# EAGLE design rfid_ctl (EAGLE 6.6.0)
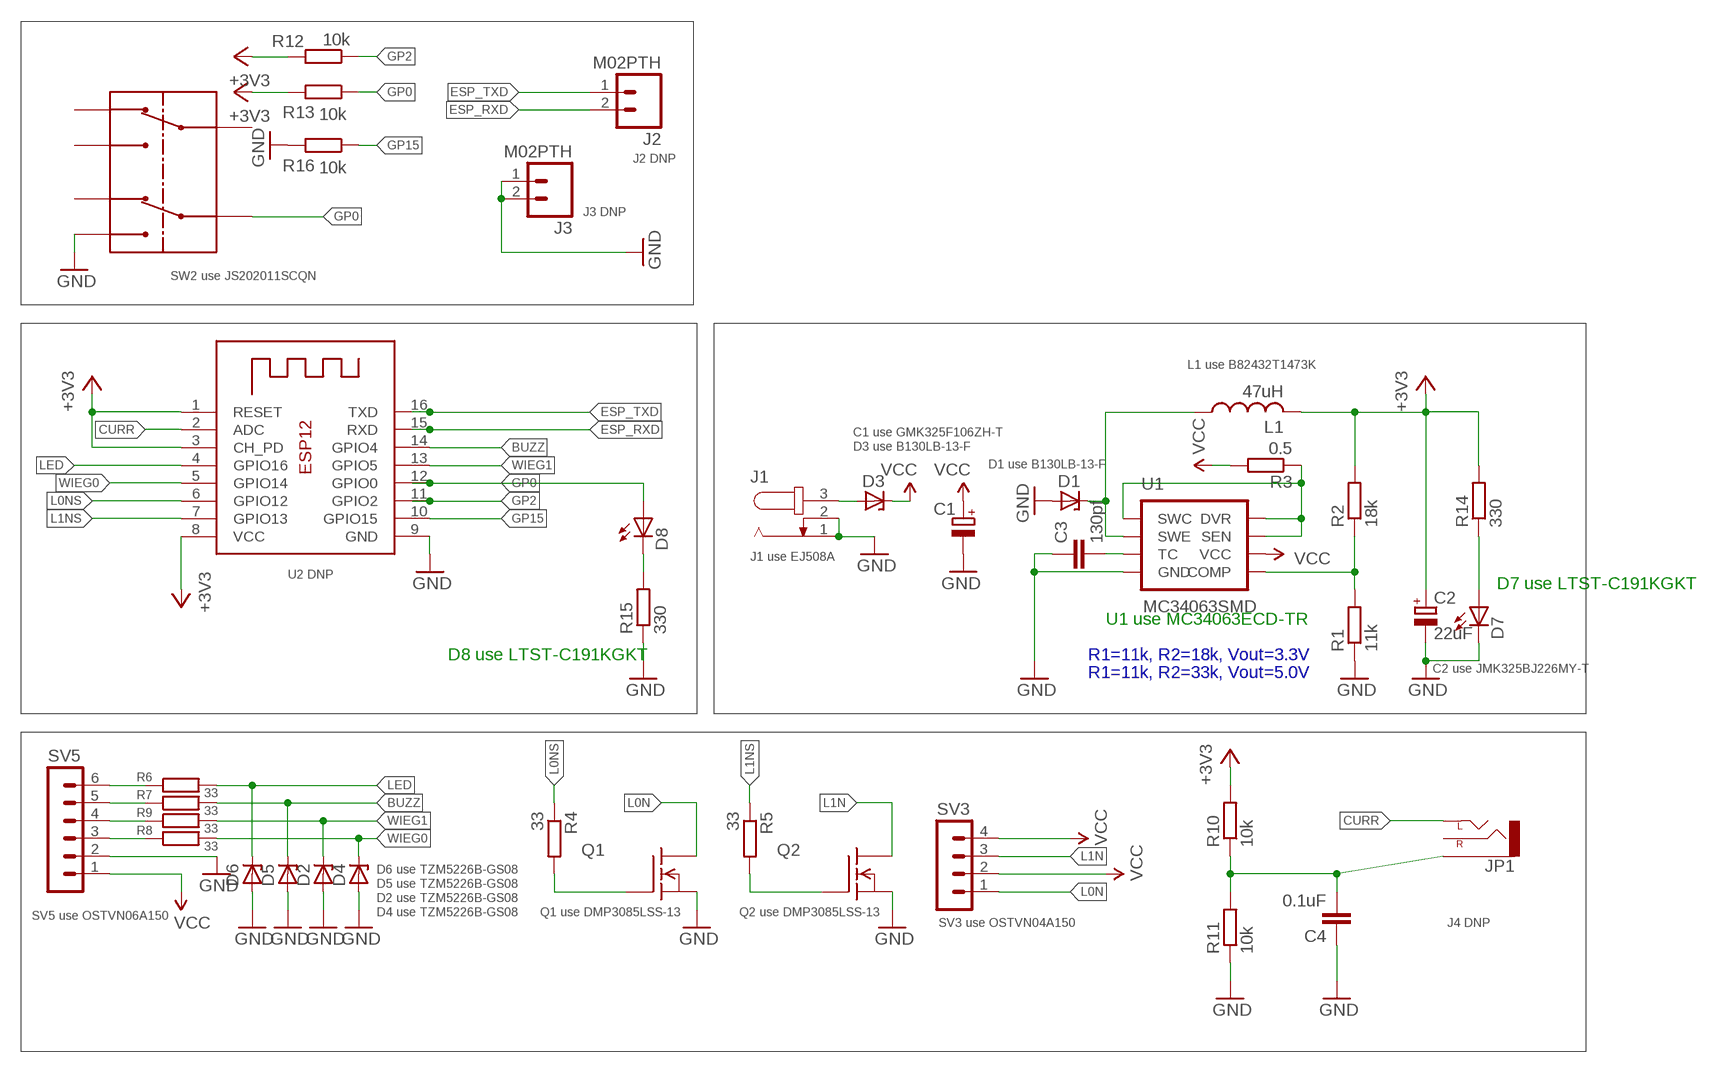
[diagram p0: schematic, sheet 1]

## Parts
C1  CPOL-EUB/3528-21R  [B/3528-21R]
C2  22uF  CPOL-EUB/3528-21R  [B/3528-21R]
C3  130pf  C-EUC0603  [C0603]
C4  0.1uF  C-EUC0603  [C0603]
D1  ZENER-DIODESMB  [SMB]
D2  ZENER-DIODESOD80C  [SOD80C]
D3  ZENER-DIODESMB  [SMB]
D4  ZENER-DIODESOD80C  [SOD80C]
D5  ZENER-DIODESOD80C  [SOD80C]
D6  ZENER-DIODESOD80C  [SOD80C]
D7  LEDCHIP-LED0603  [CHIP-LED0603]
D8  LEDCHIP-LED0603  [CHIP-LED0603]
J1  JACK-PLUG0  [SPC4077]
J2  M02PTH  [1X02]
J3  M02PTH  [1X02]
JP1  AUDIO-JACKSMD2  [AUDIO-JACK-3.5MM-SMD]
L1  47uH  L-USL1812  [L1812]
Q1  FDS5680  [SO-8]
Q2  FDS5680  [SO-8]
R1  11k  R-EU_R0603  [R0603]
R2  18k  R-EU_R0603  [R0603]
R3  0.5  R-EU_R0603  [R0603]
R4  33  R-EU_R0603  [R0603]
R5  33  R-EU_R0603  [R0603]
R6  33  R-EU_R0603  [R0603]
R7  33  R-EU_R0603  [R0603]
R8  33  R-EU_R0603  [R0603]
R9  33  R-EU_R0603  [R0603]
R10  10k  R-EU_R0603  [R0603]
R11  10k  R-EU_R0603  [R0603]
R12  10k  R-EU_R0603  [R0603]
R13  10k  R-EU_R0603  [R0603]
R14  330  R-EU_R0603  [R0603]
R15  330  R-EU_R0603  [R0603]
R16  10k  R-EU_R0603  [R0603]
SV3  MA04-1  [MA04-1]
SV5  MA06-1  [MA06-1]
SW2  L202011MS02Q  [SMT]
U1  MC34063SMD  [SO08]
U2  ESP-12  [ESP-12]

## Nets
+3V3: C2.+ L1.2 R2.2 R10.2 R12.2 R13.2 R14.2 U2.1(RESET) U2.3(CH_PD) U2.8(VCC)
BUZZ: D5.C R7.2 U2.14(GPIO4)
CURR: JP1.TIP(LEFT) U2.2(ADC)
ESP_RXD: J2.2 U2.15(RXD)
ESP_TXD: J2.1 U2.16(TXD)
GND: C1.- C2.- C3.1 C4.1 D1.A D2.A D4.A D5.A D6.A D7.C J1.1 J1.2 J3.1 J3.2 Q1.1(S) Q1.2(S) Q1.3(S) Q2.1(S) Q2.2(S) Q2.3(S) R1.1 R11.1 R15.1 R16.2 SV5.2 SW2.B1 U1.4(GND) U2.9(GND)
GP0: D8.A R13.1 SW2.B U2.12(GPIO0)
GP2: R12.1 U2.11(GPIO2)
GP15: R16.1 U2.10(GPIO15)
L0N: Q1.5(D) Q1.6(D) Q1.7(D) Q1.8(D) SV3.1
L0NS: R4.1 U2.6(GPIO12)
L1N: Q2.5(D) Q2.6(D) Q2.7(D) Q2.8(D) SV3.3
L1NS: R5.1 U2.7(GPIO13)
LED: D6.C R6.2 U2.4(GPIO16)
N$1: Q1.4(G) R4.2
N$2: C3.2 U1.3(TC)
N$3: D1.C L1.1 U1.2(SWE)
N$4: Q2.4(G) R5.2
N$5: R1.2 R2.1 U1.5(COMP)
N$6: R3.1 U1.1(SWC) U1.7(SEN) U1.8(DVR)
N$7: D3.A J1.3
N$8: R6.1 SV5.6
N$9: R7.1 SV5.5
N$10: R8.1 SV5.4
N$11: R9.1 SV5.3
N$12: C4.2 JP1.SLEEVE R10.1 R11.2
N$13: D7.A R14.1
N$14: D8.C R15.2
VCC: C1.+ D3.C R3.2 SV3.2 SV3.4 SV5.1 U1.6(VCC)
WIEG0: D4.C R9.2 U2.5(GPIO14)
WIEG1: D2.C R8.2 U2.13(GPIO5)
Unconnected: JP1.RING(RIGHT) SW2.A SW2.A1 SW2.A2 SW2.B2

## Notes on the sheet
- J2 DNP
- J3 DNP
- SW2 use JS202011SCQN
- L1 use B82432T1473K
- C1 use GMK325F106ZH-T
- D3 use B130LB-13-F
- D1 use B130LB-13-F
- J1 use EJ508A
- U2 DNP
- D7 use LTST-C191KGKT
- U1 use MC34063ECD-TR
- D8 use LTST-C191KGKT | R1=11k, R2=18k, Vout=3.3V
- C2 use JMK325BJ226MY-T
- R1=11k, R2=33k, Vout=5.0V
- D6 use TZM5226B-GS08
- D5 use TZM5226B-GS08
- D2 use TZM5226B-GS08
- D4 use TZM5226B-GS08 | Q1 use DMP3085LSS-13 | Q2 use DMP3085LSS-13
- SV5 use OSTVN06A150
- SV3 use OSTVN04A150 | J4 DNP

## Library data of the parts
C1 C2 = rcl:CPOL-EU: POLARIZED CAPACITOR, European symbol
C3 C4 = rcl:C-EU: CAPACITOR, European symbol
D1-D6 = diode:ZENER-DIODE: Z-Diode
D7 D8 = adafruit:LED: LED OSRAM: - CHIPLED LG R971, LG N971, LY N971, LG Q971, LY Q971, LO R971, LY R971 LH N974, LH R974 LS Q976, LO Q976, LY Q976 LO Q996 - Hyper CHIPLED LW Q18S LB Q993, LB Q99A, LB R99A - SideLED LS A670, LO A670, LY A670, LG A670, LP A670 LB A673, LV A673, LT A673, LW A673 LH A674 LY A675 LS A676, LA A676, LO A676, LY A676, LW A676 LS A679, LY A679, LG A679 - Hyper Micro SIDELED® LS Y876, LA Y876, LO Y876, LY Y876 LT Y87S - SmartLED LW L88C, LW L88S LB L89C, LB L89S, LG L890 LS L89K, LO L89K, LY L89K LS L896, LA L896, LO L896, LY L896 - TOPLED LS T670, LO T670, LY T670, LG T670, LP T670 LSG T670, LSP T670, LSY T670, LOP T670, LYG T670 LG T671, LOG T671, LSG T671 LB T673, LV T673, LT T673, LW T673 LH T674 LS T676, LA T676, LO T676, LY T676, LB T676, LH T676, LSB T676, LW T676 LB T67C, LV T67C, LT T67C, LS T67K, LO T67K, LY T67K, LW E67C LS E67B, LA E67B, LO E67B, LY E67B, LB E67C, LV E67C, LT E67C LW T67C LS T679, LY T679, LG T679 LS T770, LO T770, LY T770, LG T770, LP T770 LB T773, LV T773, LT T773, LW T773 LH T774 LS E675, LA E675, LY E675, LS T675 LS T776, LA T776, LO T776, LY T776, LB T776 LHGB T686 LT T68C, LB T68C - Hyper Mini TOPLED® LB M676 - Mini TOPLED Santana® LG M470 LS M47K, LO M47K, LY M47K Source: http://www.osram.convergy.de/
J1 = con-jack:JACK-PLUG: DC POWER JACK Power Jack, DC, Right Angle, Through Hole, Rated 5A at 16VDC, PC Terminals Distributor: Farnell (www.Farnell.de) Drawing: 84N1161.pdf / 84N1162.pdf Manufacturer: SPC Technology (www.spctechnology.com) Type: SPC4077 / SPC 4078; OC_FARNELL: unknown; OC_NEWARK: unknown
J2 J3 = SparkFun-Connectors:M02: Standard 2-pin 0.1" header. Use with - straight break away headers ( PRT-00116) - right angle break away headers (PRT-00553) - swiss pins (PRT-00743) - machine pins (PRT-00117) - female headers (PRT-00115) Molex polarized connector foot print use with: PRT-08233 with associated crimp pins and housings. 2.54_SCREWTERM for use with PRT-10571. 3.5mm Screw Terminal footprints for PRT-08084 5mm Screw Terminal footprints for use with PRT-08432
JP1 = SparkFun-Connectors:AUDIO-JACK: 3.5mm Audio Jack Simple 3.5mm common PCB mount audio jack. SKU: PRT-08032; PROD_ID: CONN-10353
L1 = rcl:L-US: INDUCTOR, American symbol
Q1 Q2 = transistor-fet:FDS5680: 60V N-Channel PowerTrench TM MOSFET FAIRCHILD FDS5680.pdf
R1-R16 = rcl:R-EU_: RESISTOR, European symbol
SV3 = con-lstb:MA04-1: PIN HEADER; OC_FARNELL: unknown; OC_NEWARK: unknown
SV5 = con-lstb:MA06-1: PIN HEADER; OC_FARNELL: unknown; OC_NEWARK: unknown
SW2 = JS202011SCQNC&K:L202011MS02Q
U1 = SparkFun:MC34063
U2 = adafruit:ESP-12

## Board
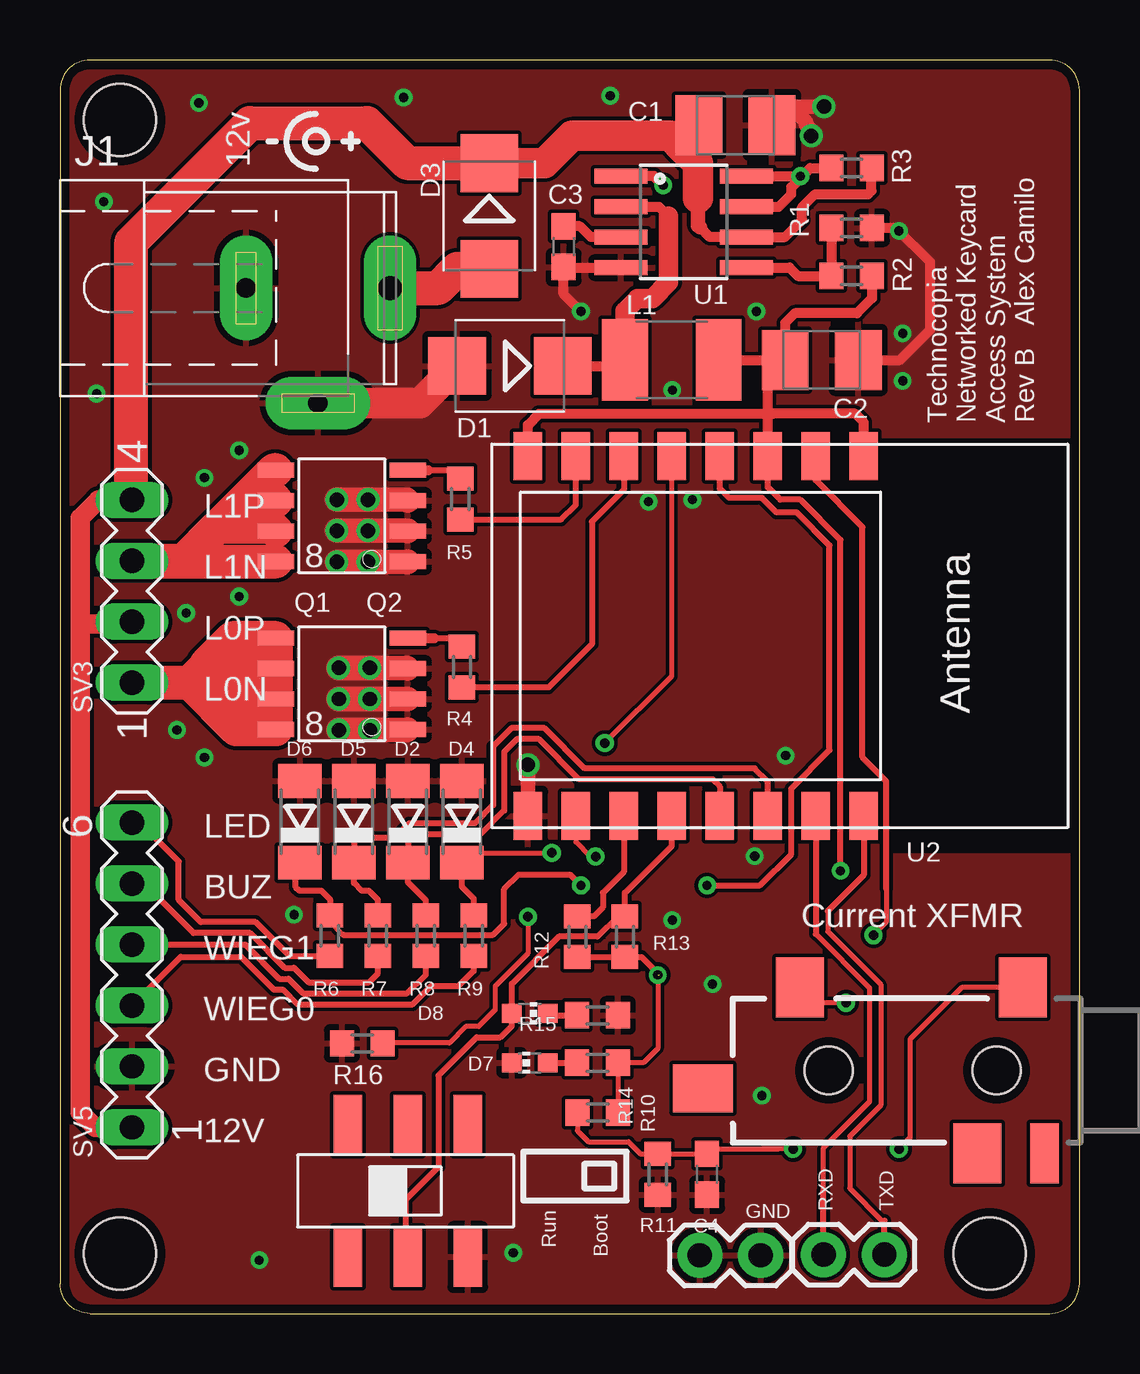
[diagram p1: board, top side]
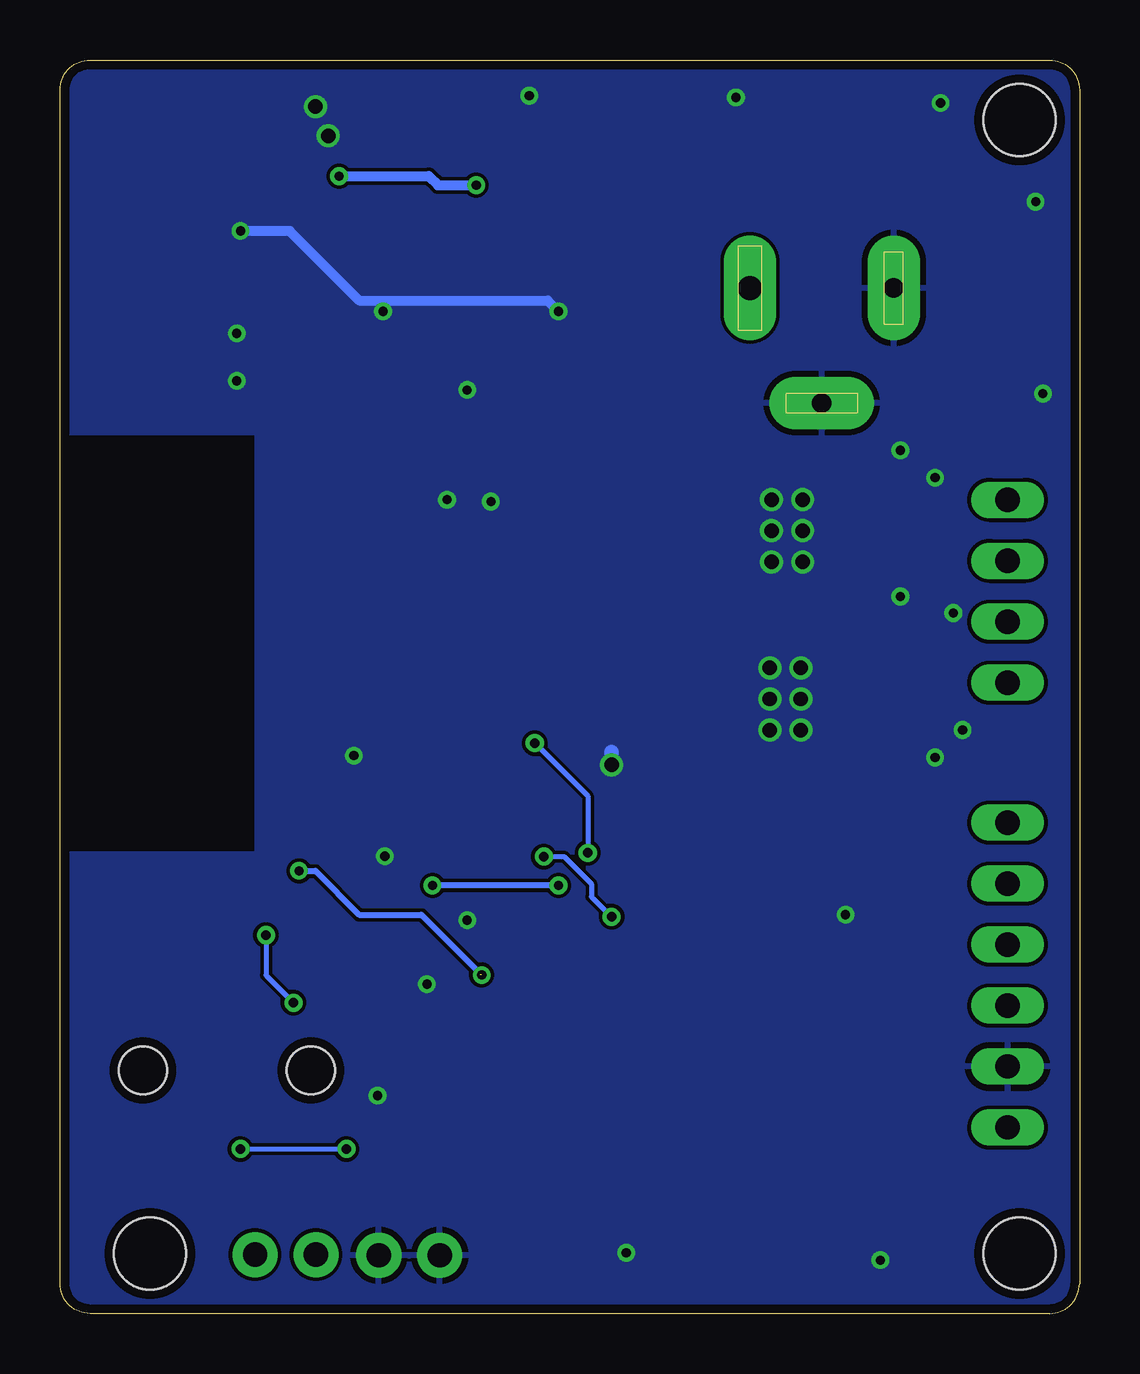
[diagram p2: board, bottom side, seen from below]

Size 42.5 x 52.25 mm. Coordinates in mm from the lower left corner, seen from the top.
Outline: 1.25,0 41.25,0 arc90 42.5,1.25 42.5,51 arc90 41.25,52.25 1.25,52.25 arc90 0,51 0,1.25 arc90 1.25,0
Copper layers (1*16): Top 0.0356mm / dielectric 1.5011mm / Bottom 0.0356mm
Design rules "LaenPCBOrder *": minimum track width 6mil, minimum drill 13mil, track to track 6mil, track to pad 6mil, pad to pad 6mil, via to via 6mil, smd to smd 6mil, copper to edge 15mil, drill to drill 6mil, minimum pad ring 7mil, minimum via ring 7mil, stop-mask expansion 3mil, vias tented up to drill 30mil, thermal gap 10mil
Holes 3 mm at 2.5,2.5 2.5,49.75 38.75,2.5

### Footprints (pad centres in the part's own frame; a part is rotated, then mirrored left to right if it is on the bottom)
B/3528-21R = smd 1.95 x 2.5: + 1.525,0; - -1.525,0
C0603 = smd 1.1 x 1: 1 -0.85,0; 2 0.85,0
SMB = smd 2.4 x 2.4: A 2.2,0; C -2.2,0
SOD80C = smd 1.4 x 1.8: A 1.7,0; C -1.7,0
CHIP-LED0603 = smd 0.8 x 0.8: A 0,-0.75; C 0,0.75
SPC4077 = drill 0.8 pad 2.184 long: 1 -3,0; 2 0,-4.8 | drill 1 pad 2.184 long: 3 3,0
1X02 = drill 1.016 pad 1.88: 1 0,0; 2 2.54,0
AUDIO-JACK-3.5MM-SMD = smd 2 x 2.5: RING 4.3,3.45; SLEEVE 2.4,-3.45; TIP 11.7,-3.45 | smd 1.2 x 2.5: RSH 1.5,3.45 | smd 2.5 x 2: TSH 15.75,0.75 | hole 2: 3.5,0; 10.5,0
L1812 = smd 1.9 x 3.4: 1 -1.95,0; 2 1.95,0
SO-8 = smd 1.524 x 0.61: 1 -2.743,1.905; 2 -2.743,0.635; 3 -2.743,-0.635; 4 -2.743,-1.905; 5 2.743,-1.905; 6 2.743,-0.635; 7 2.743,0.635; 8 2.743,1.905
R0603 = smd 1 x 1.1: 1 -0.85,0; 2 0.85,0
MA04-1 = drill 1.016 long: 1 -3.81,0; 2 -1.27,0; 3 1.27,0; 4 3.81,0
MA06-1 = drill 1.016 long: 1 -6.35,0; 2 -3.81,0; 3 -1.27,0; 4 1.27,0; 5 3.81,0; 6 6.35,0
SMT = smd 1.2 x 2.5: A 3.1,1.3; A1 0.6,1.3; A2 5.6,1.3; B 3.1,6.8; B1 0.6,6.8; B2 5.6,6.8
SO08 = smd 0.61 x 2.21: 1 -1.905,-2.616; 2 -0.635,-2.616; 3 0.635,-2.616; 4 1.905,-2.616; 5 1.905,2.616; 6 0.635,2.616; 7 -0.635,2.616; 8 -1.905,2.616
ESP-12 = smd 2 x 1.2: 1 -7.5,4.5; 2 -7.5,2.5; 3 -7.5,0.5; 4 -7.5,-1.5; 5 -7.5,-3.5; 6 -7.5,-5.5; 7 -7.5,-7.5; 8 -7.5,-9.5; 9 7.5,-9.5; 10 7.5,-7.5; 11 7.5,-5.5; 12 7.5,-3.5; 13 7.5,-1.5; 14 7.5,0.5; 15 7.5,2.5; 16 7.5,4.5

### Placement (x,y rotation side)
C1  28.16,49.53 180 top
C2  31.75,39.75 180 top
C3  21,44.47 90 top
C4  26.97,5.8 90 top
D1  18.75,39.5 180 top
D2  14.5,20.5 90 top
D3  17.89,45.75 270 top
D4  16.75,20.5 90 top
D5  12.25,20.5 90 top
D6  10,20.5 90 top
D7  19.58,10.45 90 top
D8  19.58,12.51 270 top
J1  10.75,42.75 0 top
J2  34.37,2.45 180 top
J3  26.67,2.43 0 top
JP1  42.55,10.13 180 top
L1  25.5,39.75 0 top
Q1  11.75,26.25 180 top
Q2  11.75,33.25 180 top
R1  33,45.25 180 top
R2  33,43.25 0 top
R3  33,47.75 0 top
R4  16.75,26.95 90 top
R5  16.69,33.95 90 top
R6  11.25,15.75 90 top
R7  13.25,15.75 90 top
R8  15.25,15.75 90 top
R9  17.25,15.75 90 top
R10  22.42,8.38 0 top
R11  24.92,5.8 90 top
R12  21.56,15.71 270 top
R13  23.55,15.71 270 top
R14  22.4,10.45 0 top
R15  22.4,12.43 180 top
R16  12.6,11.26 180 top
SV3  3,30.11 90 top
SV5  3,14.11 90 top
SW2  17.6,9.16 180 top
U1  26,45.5 270 top
U2  29,28.25 270 top

### Tracks (layer width: path | path; a pad name or v marks a point on that pad's centre or on a via)
+3V3  (via drill 0.38)  (1 unrouted)
  Top 0.2: v24.92,14.11 24.92,11.05 24.32,10.45 R14.2 23.27,10.44 R10.2
  Top 0.254: v32.54,18.45 32.54,32.25 30.86,33.92 30.02,33.92 29.5,34.45 U2.3 | 24.99,14.19 24.99,14.11 24.24,14.86 R13.2 R12.2 | R14.2 23.57,10.77
  Top 0.406: L1.2 29.5,39.75 | 29.5,39.75 C2.+ 30.23,41.29 30.63,41.69 33.22,41.69 33.85,42.32 R2.2 | U2.3 29.5,37.43 | 29.5,37.43 29.5,39.75 | U2.1 33.5,37.15 33.15,37.5 29.73,37.5 29.5,37.43 | U2.8 19.5,37.04 19.96,37.5 29.42,37.5 29.5,37.43
  Bottom 0.254: v32.54,18.45 31.85,18.45 30.02,16.62 27.43,16.62 v24.92,14.11
BUZZ
  Top 0.254: R7.2 13.25,17.24 12.88,17.61 12.57,17.61 12.25,17.94 D5.C 12.25,19.65 12.42,19.82 13.95,19.82 14.55,20.43 17.3,20.43 18.06,21.2 18.06,23.64 18.82,24.4 20.19,24.4 21.87,22.72 28.96,22.72 29.5,22.18 U2.14
CURR  (via drill 0.4)
  Top 0.2: 34.44,17.71 34.44,16.31 v33.91,15.77 | v32.77,12.95 31.48,12.95 JP1.TIP
  Top 0.254: 34.44,17.71 34.44,22.19 33.45,23.18 33.45,32.78 31.5,34.73 U2.2
  Bottom 0.2: v33.91,15.77 33.91,14.1 v32.77,12.95
ESP_RXD
  Top 0.2: 31.83,5.14 31.83,6.91 33.76,8.84 33.76,13.56 31.5,15.82
  Top 0.254: U2.15 31.5,15.82 | J2.2 31.83,5.14
ESP_TXD
  Top 0.2: 32,16.78 32,15.93 34.21,13.72 34.21,8.69 32.92,7.39 32.92,5.22 34.27,3.87 34.37,3.87
  Top 0.254: U2.16 33.5,18.27 32,16.78 | J2.1 34.37,3.87
GND  (via drill 0.38, 0.6 pad 0.38)
  Top 0.406: C2.- 35.01,39.75 36.27,41.01 36.27,43.83 34.85,45.25 R1.1 | U1.4 21.02,43.59 C3.1 21,42.49 v21.72,41.77
  Top 0.61: C1.- 30.45,50.3 31.09,49.67 31.09,49.54 31.32,49.31 v31.32,49.09 | 30.48,50.15 30.48,50.23 30.56,50.3 v31.85,50.3 | U2.9 v19.51,22.87
  Top 1.016: Q1.3 14.47,26.91 v11.62,26.91 | Q1.2 v11.62,25.62 | Q1.1 14.47,24.32 v11.62,24.32 | Q2.1 14.48,31.33 v11.54,31.33 | Q2.2 v11.54,32.63 | Q2.3 14.46,33.92 v11.54,33.92
  Top 1.27: D1.A 15,37.95 J1.2
  Bottom 0.406: v21.72,41.77 22.17,42.23 30.02,42.23 32.92,45.12 v34.98,45.12
  Bottom 0.61: v31.85,50.3 32,50.3 | v19.51,22.87 19.51,23.41
  other vias: 12.84,33.92 12.84,32.63 12.84,31.33 12.91,26.91 12.91,25.62 12.91,24.32 25.53,38.49 29.03,41.77 35.13,40.86 35.13,38.88 26.37,33.92 24.54,33.85 30.25,23.25 28.96,19.06 25.53,16.4 27.2,13.73 29.26,9.08 18.9,2.53 8.31,2.22 9.75,16.62 4.88,24.32 6.02,23.18 5.26,29.2 7.47,29.88 6.02,34.84 7.47,35.98 22.94,50.76 14.33,50.69 5.79,50.46 1.83,46.34 1.52,38.34
  pour Bottom: -1.68,53.28 43.21,53.28 43.21,36.74 34.29,36.74 34.29,19.14 45.26,19.14 45.26,-7.15 -1.68,-7.15
  pour Top: 43.66,36.59 34.29,36.59 34.29,19.06 44.42,19.06 44.42,-7.76 -4.57,-7.76 -4.57,60.67 43.66,60.67
GP0
  Top 0.254: 25.53,20.72 U2.12 25.5,19.49 23.55,17.54 R13.1 23.25,16.56 22.4,15.71 20.8,15.71 18.83,13.74 D8.A | SW2.B 14.4,2.46 14.4,4.74 15.77,6.11 15.77,9.92 17.37,11.52 18.36,11.52 18.83,11.99 D8.A | D8.A 18.76,12.59
GP2
  Top 0.254: U2.11 23.5,18.41 22.63,17.54 22.63,16.93 22.26,16.56 R12.1
GP15  (via drill 0.4)
  Top 0.2: U2.10 21.5,19.65 22.1,19.05 v22.33,19.05 | v19.51,16.54 19.51,15.01 18.14,13.64 18.14,12.65 17.45,11.96 16.92,11.96 16.23,11.28 13.47,11.28 R16.1
  Bottom 0.2: v22.33,19.05 21.49,19.05 20.34,17.91 20.34,17.37 v19.51,16.54
L0N
  Top 1.422: SV3.1 5.4,26.3 | 5.4,26.3 6.29,27.18 | 6.29,27.18 7.01,27.9 9,27.9 | 5.4,26.3 7.35,24.34 Q1.8 Q1.7 | Q1.7 Q1.6 | Q1.6 Q1.5 7.19,28.16 6.1,27.06 | Q1.6 6.58,26.89 6.29,27.18 | Q1.7 7.24,25.61 6.86,26
L0NS
  Top 0.254: U2.6 23.5,34.33 22.17,33.01 22.17,27.9 20.37,26.1 R4.1
L1N
  Top 1.422: Q2.5 8.93,35.16 7.81,34.04 | 7.81,34.04 6.55,32.78 | 6.55,32.78 5.15,31.38 SV3.3 3.03,31.34 Q2.8 | Q2.7 8.84,32.78 6.55,32.78 | Q2.6 8.86,34.04 7.81,34.04
L1NS
  Top 0.254: R5.1 20.89,33.1 21.5,33.7 U2.7
LED  (via drill 0.38 pad 0.38)
  Top 0.2: 11.81,15.79 11.25,16.35 R6.2
  Top 0.254: R6.2 11.28,16.63 11.28,17.23 10.9,17.61 9.98,17.61 9.83,17.77 9.83,18.8 D6.C | 11.81,15.79 18.06,15.79 18.52,16.24 18.52,17.69 19.13,18.3 21.26,18.3 v21.72,17.84 | v26.98,17.84 29.18,17.84 30.48,19.14 30.48,21.88 32.08,23.48 32.08,32.02 30.71,33.39 29.87,33.39 29.26,34 27.89,34 27.5,34.39 U2.4
  Bottom 0.254: v21.72,17.84 v26.98,17.84
N$1
  Top 0.254: 15.6,28.16 16.39,28.16 R4.2
  Top 0.406: Q1.4 15.6,28.16
N$2
  Top 0.406: U1.3 22.13,44.87 21.68,45.32 C3.2
N$3
  Top 0.406: D1.C 23.55,39.5 L1.1 | U1.2 24.97,46.13 25.38,45.73
  Top 0.813: 25.38,45.73 25.38,42.99 24.69,42.3 24.08,42.3 23.55,41.77 L1.1
N$4
  Top 0.254: 15.35,35.16 16.33,35.16 R5.2
  Top 0.406: Q2.4 15.35,35.16 | 16.64,34.75 R5.2
N$5
  Top 0.406: U1.5 30.41,43.59 30.75,43.25 R2.1 R1.2
N$6  (via drill 0.38 pad 0.38)
  Top 0.406: 30.93,47.41 U1.8 v30.86,47.41 | 30.93,47.41 31.28,47.75 R3.1 | U1.7 29.97,46.13 30.48,46.65 30.48,46.95 30.93,47.41 | v25.15,47.03 24.77,47.41 U1.1
  Bottom 0.406: v30.86,47.41 27.13,47.41 26.75,47.03 v25.15,47.03
N$7
  Top 1.422: J1.3 15.76,42.75 16.56,43.55 D3.A
N$8
  Top 0.254: R6.1 9.57,14.9 8.15,16.32 5.87,16.32 4.95,17.23 4.95,18.83 3.33,20.46 SV5.6
N$9
  Top 0.254: R7.1 13.25,14.18 12.88,13.8 10.36,13.8 9.75,14.41 9.37,14.41 7.92,15.86 5.56,15.86 3.5,17.92 SV5.5
N$10
  Top 0.254: SV5.4 7.72,15.38 9.14,13.96 9.53,13.96 10.13,13.35 14.48,13.35 15.25,14.12 R8.1
N$11
  Top 0.254: SV5.3 5.03,14.87 7.54,14.87 8.91,13.5 9.3,13.5 9.91,12.89 14.71,12.89 15.47,13.65 16.61,13.65 17.22,14.26 arc90 17.25,14.29 R9.1
N$12  (via drill 0.4)
  Top 0.2: R10.1 21.57,7.62 22.02,7.16 23.7,7.16 | JP1.SLEEVE 37.59,13.59 35.43,11.43 35.43,7.32 v34.98,6.86 | v30.56,6.86 29.95,6.86 29.26,6.86
  Top 0.203: 23.7,7.16 24.21,6.65 R11.2 C4.2 27.18,6.86 29.95,6.86
  Bottom 0.2: v34.98,6.86 v30.56,6.86
N$13
  Top 0.254: D7.A R14.1
N$14
  Top 0.254: D8.C 20.41,12.43 R15.2
VCC
  Top 0.406: R3.2 33.83,47.73 33.83,46.8 33.68,46.65 31.47,46.65 30.94,46.11 30.94,45.58 30.22,44.87 U1.6 27.08,44.87 26.67,45.28
  Top 0.61: 26.67,45.28 26.59,45.35 26.59,46.49
  Top 0.813: SV3.4 1.59,33.91 0.84,33.16 0.84,28.74 | 0.84,28.74 0.84,8.39 1.47,7.76 SV5.1 | SV3.2 2.9,28.74 0.84,28.74
  Top 1.27: 26.59,46.49 26.59,47.94 26.06,48.48 | 26.06,48.48 25.45,49.09 21.34,49.09 20.2,47.95 D3.C | C1.+ 26.62,49.54 26.59,49.54 26.06,49.01 26.06,48.48
  Top 1.422: SV3.4 2.97,33.94 2.97,44.67 7.92,49.62 12.8,49.62 14.47,47.95 D3.C
WIEG0  (via drill 0.4)
  Top 0.2: v22.71,23.77 25.5,26.57 U2.5 | D4.C 17.15,19.2 v20.5,19.2
  Top 0.254: R9.2 17.25,17.28 16.75,17.78 D4.C
  Bottom 0.2: v22.71,23.77 20.5,21.57 v20.5,19.2
WIEG1
  Top 0.254: R8.2 15.25,17.22 14.5,17.97 D2.C 14.5,19.7 14.78,19.98 17.53,19.98 18.52,20.97 18.52,23.41 19.05,23.94 19.96,23.94 21.64,22.26 27.2,22.26 27.51,21.96 U2.13

### Text on the board
tPlace: 12v | Technocopia / Networked Keycard / Access System / Rev B Alex Camilo | L1P | L1N | L0P | L0N | LED | BUZ | Current XFMR | WIEG1 | WIEG0 | GND | 12V | GND | RXD | TXD | Run | Boot